# Altium schematic sheet USB A Filter.SchDoc
size B
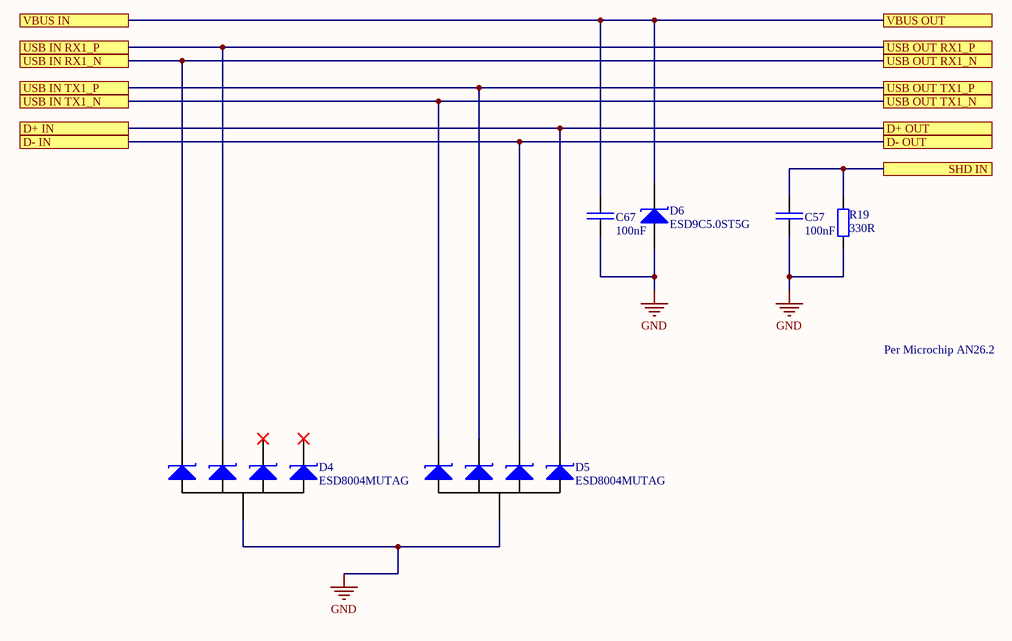
[diagram p0: USB A Filter.SchDoc]

## Parts
C57  100nF  [CAP_SM0603_YAGEOCC2_N]
C67  100nF  [CAP_SM0603_YAGEOCC2_N]
D4  ESD8004MUTAG  [ESD8004MUTAG]
D5  ESD8004MUTAG  [ESD8004MUTAG]
D6  ESD9C5.0ST5G  [SODFL100X40-2N - ESD9C5.0ST5G]
R19  330R  [RES_SM0603_YAGEORC_N]

## Ports
D+ IN, D+ OUT, D- IN, D- OUT, SHD IN, USB IN RX1_N, USB IN RX1_P, USB IN TX1_N, USB IN TX1_P, USB OUT RX1_N, USB OUT RX1_P, USB OUT TX1_N, USB OUT TX1_P, VBUS IN, VBUS OUT

## Nets
GND: C57.2 C67.2 D4.GND(A) D5.GND(A) D6.2 R19.1
D+ IN: D5.5(K) ; port D+ IN, port D+ OUT
D- IN: D5.4(K) ; port D- IN, port D- OUT
SHD IN: C57.1 R19.2 ; port SHD IN
USB IN RX1_N: D4.1(K) ; port USB IN RX1_N, port USB OUT RX1_N
USB IN RX1_P: D4.2(K) ; port USB IN RX1_P, port USB OUT RX1_P
USB IN TX1_N: D5.1(K) ; port USB IN TX1_N, port USB OUT TX1_N
USB IN TX1_P: D5.2(K) ; port USB IN TX1_P, port USB OUT TX1_P
VBUS IN: C67.1 D6.1(K) ; port VBUS IN, port VBUS OUT

Not connected (* = marked no-connect by the designer): D4 4(K)* 5(K)*

## Notes on the sheet
- Per Microchip AN26.2

## Library data of the parts
C57 C67 = CC0603KRX7R9BB104: CAP 100nF SM0603 X7R 50V YAGEO CC2; Tolerance (%): 10; Voltage Rating (Volts): 50; Category: Capacitor; Manufacturer: Yageo; Manufacturer Part Number: CC0603KRX7R9BB104; Package: 0603; Value: 100nF; Supplier Part Number 1: 1362556; Supplier 1: Farnell; ComponentLink1URL: http://www.yageo.com; ComponentLink1Description: Manufacturer Website; Supplier 2: Digi-Key; Supplier Part Number 2: 311-1344-1-ND
D4 D5 = ESD8004MUTAG: TVS DIODE 3.3VWM 8VC 10UDFN
D6 = ESD9C5.0ST5G: TVS DIODE 5VWM SOD923
R19 = RC0603FR-07330RL: RES 330R SM0603 YAGEO RC_L; Power (Watts): 0.1; Resistance (Ohms): 330; Tolerance (%): 1; Category: Resistor; Manufacturer: Yageo; Manufacturer Part Number: RC0603FR-07330RL; Package: 0603; Value: 330R; Supplier Part Number 1: 9238425; Supplier 1: Farnell; ComponentLink1URL: http://www.yageo.com; ComponentLink1Description: Manufacturer Website; Supplier 2: Digi-Key; Supplier Part Number 2: 311-330HRCT-ND